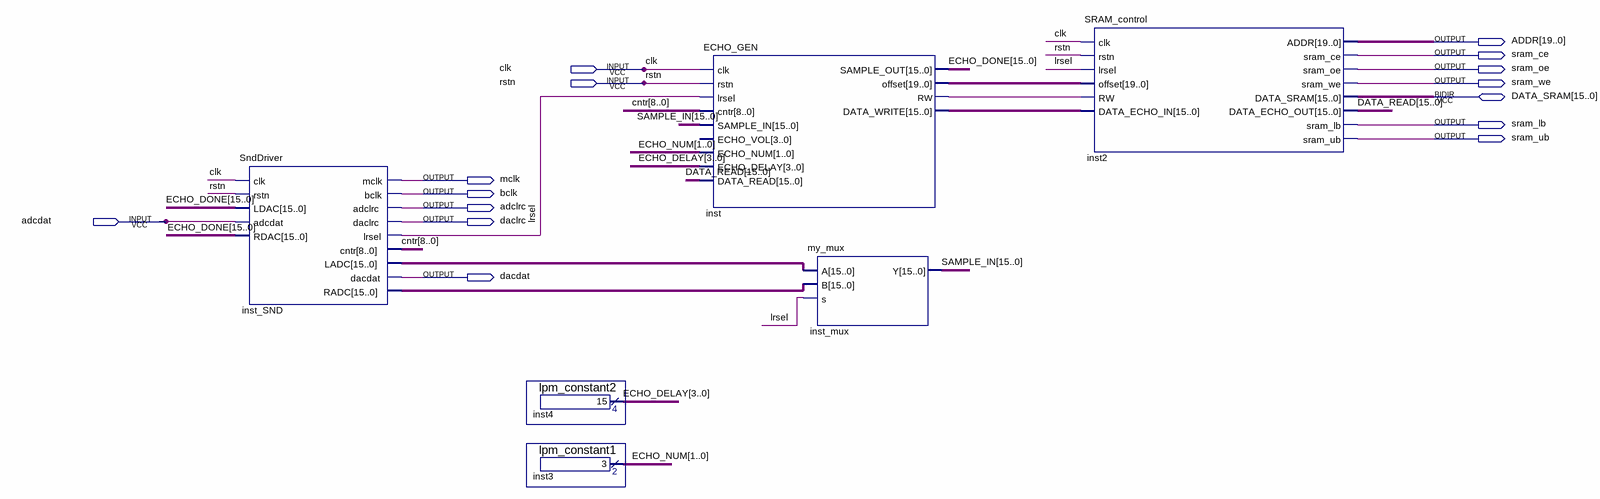
[diagram p0: schematic sheet]
// Quartus schematic SRAM_TEST.bdf as structural Verilog: 6 symbols, 15 pins
module SRAM_TEST (
  input  clk,
  input  rstn,
  input  adcdat,
  inout  [15:0] DATA_SRAM,
  output [19:0] ADDR,
  output sram_ce,
  output sram_oe,
  output sram_we,
  output sram_lb,
  output sram_ub,
  output mclk,
  output bclk,
  output adclrc,
  output daclrc,
  output dacdat
);

  wire inst_rw, lrsel;
  wire [1:0] ECHO_NUM;
  wire [3:0] ECHO_DELAY;
  wire [8:0] cntr;
  wire [15:0] DATA_READ, ECHO_DONE, inst_data_write, inst_SND_ladc, inst_SND_radc, SAMPLE_IN;
  wire [19:0] inst_offset;

  SndDriver inst_SND (
    .clk(clk), .rstn(rstn), .LDAC(ECHO_DONE), .adcdat(adcdat), .RDAC(ECHO_DONE), .mclk(mclk), .bclk(bclk),
    .adclrc(adclrc), .daclrc(daclrc), .lrsel(lrsel), .cntr(cntr), .LADC(inst_SND_ladc), .dacdat(dacdat),
    .RADC(inst_SND_radc));
  lpm_constant2 inst4 (.result(ECHO_DELAY));
  lpm_constant1 inst3 (.result(ECHO_NUM));
  ECHO_GEN inst (
    .clk(clk), .rstn(rstn), .lrsel(lrsel), .cntr(cntr), .SAMPLE_IN(SAMPLE_IN), .ECHO_NUM(ECHO_NUM),
    .ECHO_DELAY(ECHO_DELAY), .DATA_READ(DATA_READ), .SAMPLE_OUT(ECHO_DONE), .offset(inst_offset),
    .RW(inst_rw), .DATA_WRITE(inst_data_write));  // open: ECHO_VOL
  my_mux inst_mux (.A(inst_SND_ladc), .B(inst_SND_radc), .s(lrsel), .Y(SAMPLE_IN));
  SRAM_control inst2 (
    .clk(clk), .rstn(rstn), .lrsel(lrsel), .offset(inst_offset), .RW(inst_rw),
    .DATA_ECHO_IN(inst_data_write), .ADDR(ADDR), .sram_ce(sram_ce), .sram_oe(sram_oe), .sram_we(sram_we),
    .DATA_ECHO_OUT(DATA_READ), .sram_lb(sram_lb), .sram_ub(sram_ub), .DATA_SRAM(DATA_SRAM));
endmodule
